# Altium schematic sheet ExampleSchematic2.SchDoc
size A4
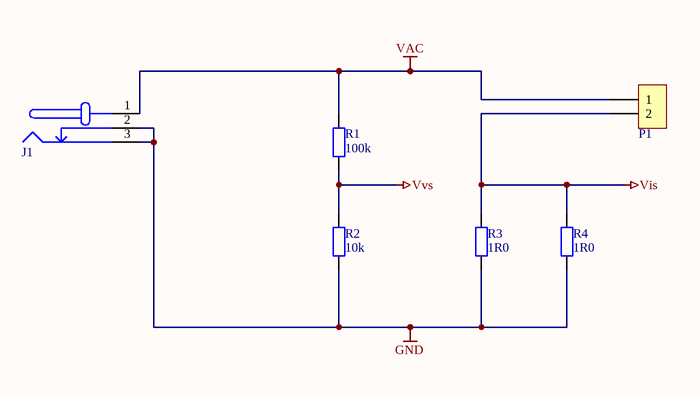
[diagram p0: ExampleSchematic2.SchDoc]

## Parts
J1  DC barrel jack  [AC-Socket]  (value not drawn)
P1  Dual Banana Plugs  [Dual Banana Plug]  (value not drawn)
R1  100k  [AXIAL-0.4]
R2  10k  [AXIAL-0.4]
R3  1R0  [AXIAL-0.4]
R4  1R0  [AXIAL-0.4]

## Nets
GND: J1.2(GND_ALT) J1.3(GND) R2.1 R3.1 R4.1
VAC: J1.1(VCC) P1.1 R1.2
Vis: P1.2 R3.2 R4.2
Vvs: R1.1 R2.2

## Library data of the parts
J1 = AC_Input: DC barrel jack connection to AC source; Value: socket
P1 = AC_Output: Dual banana plugs connection to the AC load; LatestRevisionDate: 17-Jul-2002; LatestRevisionNote: Re-released for DXP Platform.; Publisher: Altium Limited
R1-R4 = Res_TH_0AX4: Through hole resistor; Published: 8-Jun-2000; LatestRevisionDate: 17-Jul-2002; LatestRevisionNote: Re-released for DXP Platform.; PackageReference: AXIAL-0.4; Publisher: Altium Limited; Value: *; ComponentLink1Description: http://www.royalohm.com/pdf/product2017/PrecisionMetalMF.pdf